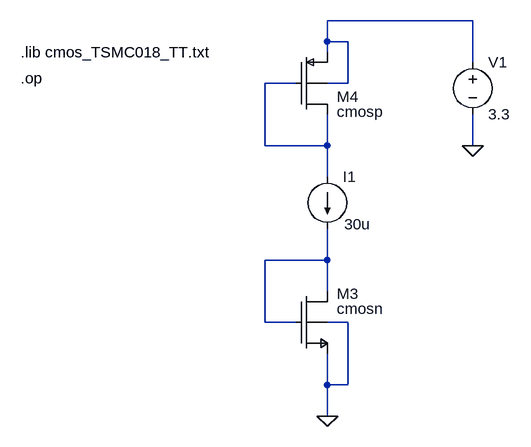
[diagram p0: schematic parametrii.asc]
parametrii.asc, the LTspice schematic file:
Version 4
SHEET 1 880 852
WIRE 288 160 64 160
WIRE 64 192 64 160
WIRE 96 192 64 192
WIRE 64 208 64 192
WIRE 288 224 288 160
WIRE 16 256 -32 256
WIRE 96 256 96 192
WIRE 96 256 64 256
WIRE -32 352 -32 256
WIRE 64 352 64 304
WIRE 64 352 -32 352
WIRE 288 352 288 304
WIRE 64 400 64 352
WIRE 64 528 64 480
WIRE 64 528 -32 528
WIRE 64 576 64 528
WIRE -32 624 -32 528
WIRE 16 624 -32 624
WIRE 96 624 64 624
WIRE 64 720 64 672
WIRE 96 720 96 624
WIRE 96 720 64 720
WIRE 64 768 64 720
FLAG 64 768 0
FLAG 288 352 0
SYMBOL nmosb 16 576 R0
SYMATTR InstName M3
SYMATTR Value cmosn
SYMATTR Value2 l=1u w=5u ad=1p as=1p pd=10.4u ps=10.4u m=1
SYMBOL pmosb 16 208 R0
SYMATTR InstName M4
SYMATTR Value cmosp
SYMATTR Value2 l=1u w=15u ad=3p as=3p pd=30.4u ps=30.4u m=1
SYMBOL current 64 400 R0
WINDOW 123 0 0 Left 2
WINDOW 39 0 0 Left 2
WINDOW 3 26 73 Left 2
SYMATTR InstName I1
SYMATTR Value 30u
SYMBOL voltage 288 208 R0
WINDOW 123 0 0 Left 2
WINDOW 39 0 0 Left 2
SYMATTR InstName V1
SYMATTR Value 3.3
TEXT -408 208 Left 2 !.lib cmos_TSMC018_TT.txt
TEXT -408 248 Left 2 !.op

The netlist it stands for:
* parametrii.asc
M3 N003 N003 0 0 cmosn l=1u w=5u ad=1p as=1p pd=10.4u ps=10.4u m=1
M4 N002 N002 N001 N001 cmosp l=1u w=15u ad=3p as=3p pd=30.4u ps=30.4u m=1
I1 N002 N003 30u
V1 N001 0 3.3
.model NMOS NMOS
.model PMOS PMOS
.lib standard.mos
.lib cmos_TSMC018_TT.txt
.op
.backanno
.end